# Altium schematic sheet RS485.SchDoc
size A
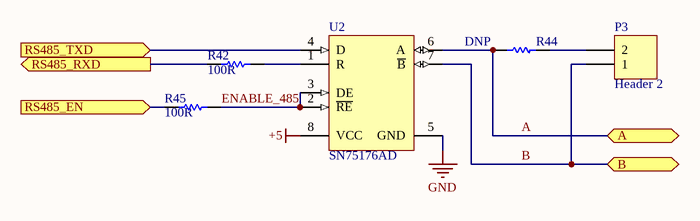
[diagram p0: RS485.SchDoc]

## Parts
P3  Header 2  [HDR1X2]
R42  100R  [0805]
R44  DNP  [0805]
R45  100R  [0805]
U2  SN75176AD  [soic-8]

## Ports
A (bidir), B (bidir), RS485_EN (in), RS485_RXD (out), RS485_TXD (in)

## Nets
+5: U2.8(VCC)
GND: U2.5(GND)
A: R44.2 U2.6(A) ; port A
B: P3.1 U2.7(~{B}) ; port B
ENABLE_485: R45.2 U2.2(~{RE}) U2.3(DE)
RS485_EN: R45.1 ; port RS485_EN
RS485_RXD: R42.1 ; port RS485_RXD
RS485_TXD: U2.4(D) ; port RS485_TXD
NetP3_2: P3.2 R44.1
NetR42_2: R42.2 U2.1(R)

## Library data of the parts
P3 = Header 2: Header, 2-Pin; LatestRevisionDate: 17-Jul-2002; LatestRevisionNote: Re-released for DXP Platform.; Publisher: Altium Limited
R42 R45 = Resistor_SMD: Resistor; Value: 200R; Telorance: 5%; Power: 0.125W; Supplier 1: Digi-Key; Supplier 2: Newark; Supplier 3: Farnell; Supplier Part Number 1: 311-1.0KARCT-ND; Supplier Part Number 2: 68R0253; Supplier Part Number 3: 2413776
R44 = 1-ResistorW: Resistor
U2 = SN75176AD: Differential Bus Transceiver, 1 TX / 1 RX, 5V, 0 to 70 degC, 8-Pin SOIC (D), Green (RoHS & no Sb/Br); Manufacturer: Texas Instruments; SubFamily: RS-422; Drivers Per Package: 1; ICC(Max)(mA): 50; Supply Voltage(s)(V): 5; ESD(kV): 2; Rating: Catalog; DatasheetVersion: SLLS100A; PackageVersion: revM, Jun-2011; PackageReference: D8; PackageDescription: 8-Pin Plastic Small Outline Integrated Circuit, 4.9 x 3.9 mm, Pitch 1.27 mm Pitch; PartNumber: SN75176AD; Mounting Technology: Surface Mount; Eco-Plan: Green (RoHS & no Sb/Br); Receivers Per Package: 1; # of TX/RX: 1 TX / 1 RX; Footprint: SN75176; Isolated: No; Code_JEDEC: MS-012AA; ComponentLink1Description: Datasheet; ComponentLink1URL: http://www.ti.com/general/docs/lit/getliterature.tsp?genericPartNumber=SN75176A&fileType=pdf; ComponentLink2Description: Package Specification; ComponentLink2URL: http://www.ti.com/lit/ml/msoi002j/msoi002j.pdf